# Altium schematic sheet boxer_irrigation.SchDoc: Irrigation Module
size A3; DrawnBy: Damian Dolewski; DocumentNumber: 1; SheetNumber: 5; SheetTotal: 7
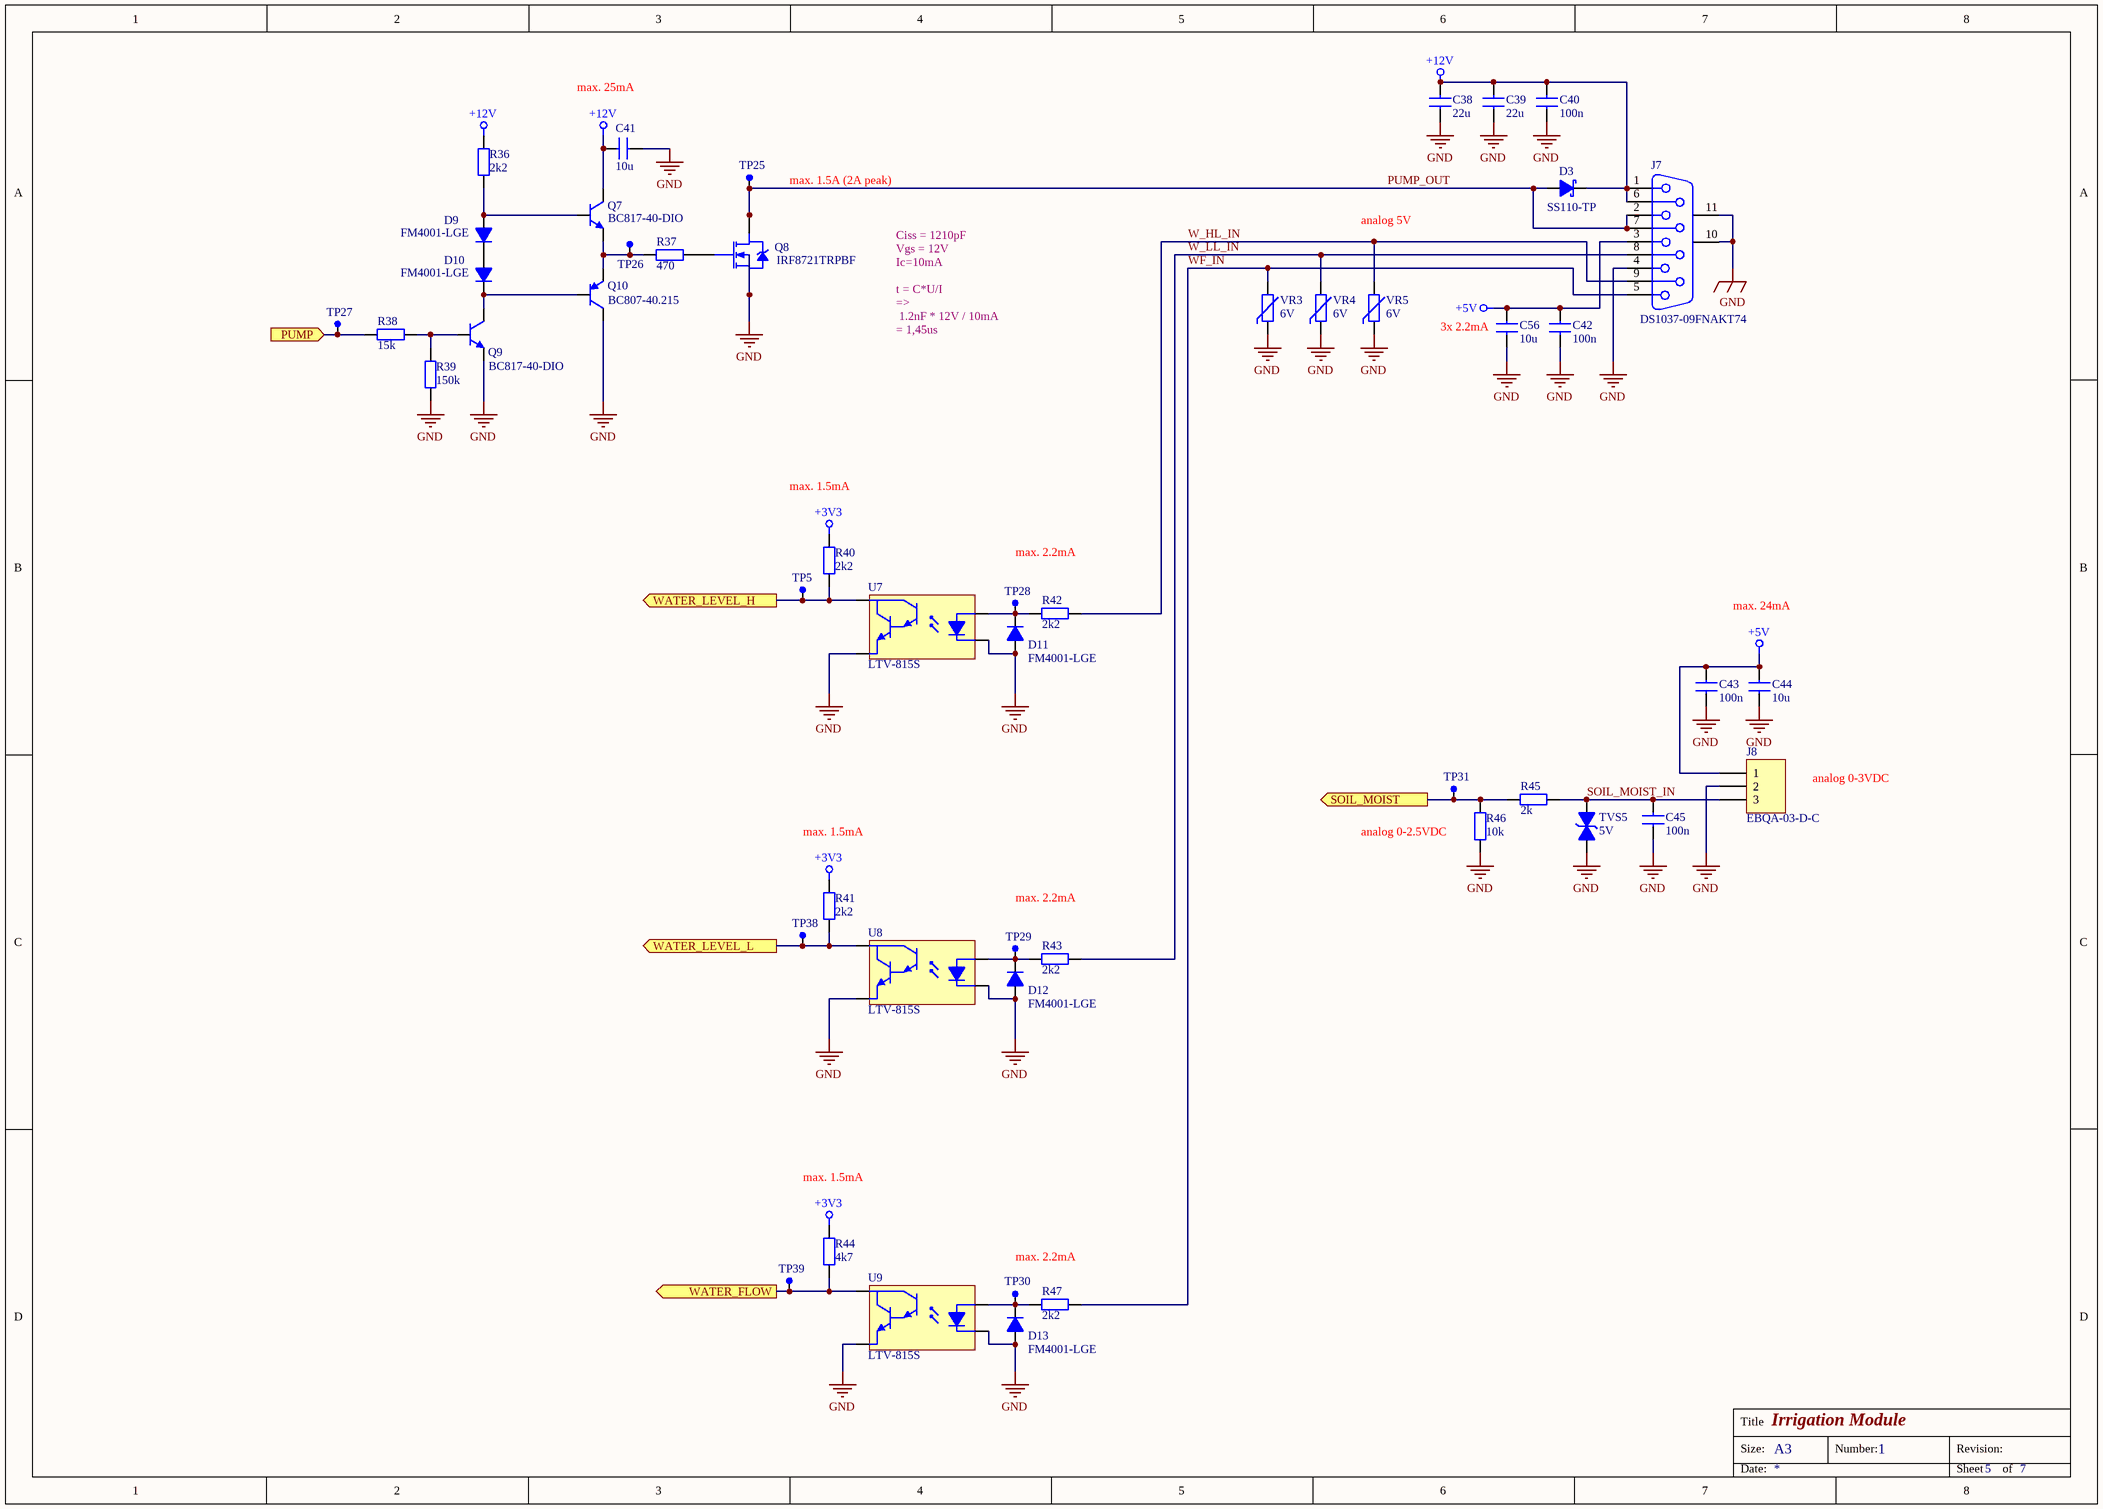
[diagram p0: boxer_irrigation.SchDoc]

## Parts
C38  value 22u  [C_1206]  (hidden comment: TME: CL31A226MOCLNNC)
C39  value 22u  [C_1206]  (hidden comment: TME: CL31A226MOCLNNC)
C40  value 100n  [C_0805]  (hidden comment: Capacitor)
C41  value 10u  [C_1206]  (hidden comment: TME: CL31A226MOCLNNC)
C42  value 100n  [C_0805]  (hidden comment: Capacitor)
C43  value 100n  [C_0805]  (hidden comment: Capacitor)
C44  value 10u  [C_1206]  (hidden comment: TME: CL31A226MOCLNNC)
C45  value 100n  [C_0805]  (hidden comment: Capacitor)
C56  value 10u  [C_1206]  (hidden comment: TME: CL31A226MOCLNNC)
D3  SS110-TP  [D_SMA]
D9  FM4001-LGE  [SOD123F]
D10  FM4001-LGE  [SOD123F]
D11  FM4001-LGE  [SOD123F]
D12  FM4001-LGE  [SOD123F]
D13  FM4001-LGE  [SOD123F]
J7  DS1037-09FNAKT74  [DB9]
J8  EBQA-03-D-C  [284512-3]
Q7  BC817-40-DIO  [SOT-23]
Q8  IRF8721TRPBF  [SO8]
Q9  BC817-40-DIO  [SOT-23]
Q10  BC807-40.215  [SOT-23]
R36  value 2k2  [R_0805]  (hidden comment: Resistor)
R37  value 470  [R_1206]  (hidden comment: Resistor)
R38  value 15k  [R_0805]  (hidden comment: Resistor)
R39  value 150k  [R_0805]  (hidden comment: Resistor)
R40  value 2k2  [R_0805]  (hidden comment: Resistor)
R41  value 2k2  [R_0805]  (hidden comment: Resistor)
R42  value 2k2  [R_0805]  (hidden comment: Resistor)
R43  value 2k2  [R_0805]  (hidden comment: Resistor)
R44  value 4k7  [R_0805]  (hidden comment: Resistor)
R45  value 2k  [R_0805]  (hidden comment: Resistor)
R46  value 10k  [R_1206]  (hidden comment: Resistor)
R47  value 2k2  [R_0805]  (hidden comment: Resistor)
TP5  TEST PAD  [PIN]  (value not drawn)
TP25  TEST PAD  [PIN]  (value not drawn)
TP26  TEST PAD  [PIN]  (value not drawn)
TP27  TEST PAD  [PIN]  (value not drawn)
TP28  TEST PAD  [PIN]  (value not drawn)
TP29  TEST PAD  [PIN]  (value not drawn)
TP30  TEST PAD  [PIN]  (value not drawn)
TP31  TEST PAD  [PIN]  (value not drawn)
TP38  TEST PAD  [PIN]  (value not drawn)
TP39  TEST PAD  [PIN]  (value not drawn)
TVS5  value 5V  [D_SMA]  (hidden comment: SMAJ5.0ALFCT-ND)
U7  LTV-815S  [SO4]
U8  LTV-815S  [SO4]
U9  LTV-815S  [SO4]
VR3  value 6V  [VR_0805]  (hidden comment: AMCV-0805-260-C800N-T)
VR4  value 6V  [VR_0805]  (hidden comment: AMCV-0805-260-C800N-T)
VR5  value 6V  [VR_0805]  (hidden comment: AMCV-0805-260-C800N-T)

## Ports
PUMP (in), SOIL_MOIST (out), WATER_FLOW (out), WATER_LEVEL_H (out), WATER_LEVEL_L (out)

## Nets
+3V3: R40.2 R41.2 R44.2
+5V: C42.2 C43.2 C44.2 C56.1 J7.3 J8.1
+12V: C38.2 C39.2 C40.2 C41.1 D3.2(K) J7.1 J7.6 Q7.3(C) R36.2
GND: C38.1 C39.1 C40.1 C41.2 C42.1 C43.1 C44.1 C45.1 C56.2 D11.1(A) D12.1(A) D13.1(A) J7.4 J7.10(MH1) J7.11(MH2) J8.2 Q8.1(S) Q8.2(S) Q8.3(S) Q9.2(E) Q10.3(C) R39.1 R46.1 TVS5.1(A) U7.2(K) U7.4(E) U8.2(K) U8.4(E) U9.2(K) U9.4(E) VR3.2 VR4.2 VR5.2
PUMP: R38.1 TP27.1 ; port PUMP
PUMP_OUT: D3.1(A) J7.2 J7.7 Q8.5(D) Q8.6(D) Q8.7(D) Q8.8(D) TP25.1
SOIL_MOIST: R45.1 R46.2 TP31.1 ; port SOIL_MOIST
SOIL_MOIST_IN: C45.2 J8.3 R45.2 TVS5.2(K)
W_HL_IN: J7.9 R42.1 VR5.1
W_LL_IN: J7.8 R43.1 VR4.1
WATER_FLOW: R44.1 TP39.1 U9.3(C) ; port WATER_FLOW
WATER_LEVEL_H: R40.1 TP5.1 U7.3(C) ; port WATER_LEVEL_H
WATER_LEVEL_L: R41.1 TP38.1 U8.3(C) ; port WATER_LEVEL_L
WF_IN: J7.5 R47.1 VR3.1
NetD9_1: D9.1(A) Q7.1(B) R36.1
NetD9_2: D9.2(K) D10.1(A)
NetD10_2: D10.2(K) Q9.3(C) Q10.1(B)
NetD11_2: D11.2(K) R42.2 TP28.1 U7.1(A)
NetD12_2: D12.2(K) R43.2 TP29.1 U8.1(A)
NetD13_2: D13.2(K) R47.2 TP30.1 U9.1(A)
NetQ7_2: Q7.2(E) Q10.2(E) R37.2 TP26.1
NetQ8_4: Q8.4(G) R37.1
NetQ9_1: Q9.1(B) R38.2 R39.2

## Notes on the sheet
- (near C41) max. 25mA
- max. 1.5A (2A peak)
- analog 5V
- Ciss = 1210pF
  Vgs = 12V
  Ic=10mA
  t = C*U/I
  =>
  1.2nF * 12V / 10mA
  = 1,45us
- (near C56) 3x 2.2mA
- (near R40) max. 1.5mA
- max. 2.2mA
- max. 24mA
- analog 0-3VDC
- (near R41) max. 1.5mA
- analog 0-2.5VDC
- (near R44) max. 1.5mA
- Title
- Size:
- A3
- Number:
- Revision:
- Date:
- Sheet
- of

## Library data of the parts
C38 C39 C41 C44 C56 = Capacitor
D3 = Diode Schottky: Schottky Diode; Value: SS110-TP
D9-D13 = Diode: Value: FM4001-LGE
J7 = DB9: Receptacle Assembly, 9 Position, Right Angle; Value: DS1037-09FNAKT74
J8 = Header 3: Header, 3-Pin; Value: EBQA-03-D-C
Q7 Q9 = NPN: NPN Bipolar Transistor; Value: BC817-40-DIO
Q8 = MOSFET-N_SO8: N-Channel MOSFET; Value: IRF8721TRPBF
Q10 = PNP: Value: BC807-40.215
TP5 TP25-TP31 TP38 TP39 = TEST_PAD: PAD 1.5mm
TVS5 = Transil
U7-U9 = Optocoupler_Darlington: Optocoupler Darlington NPN; Value: LTV-815S
VR3-VR5 = Varistor: 34.5V 20A Varistor 1 Circuit Surface Mount, MLCV 0805 (2012 Metric)